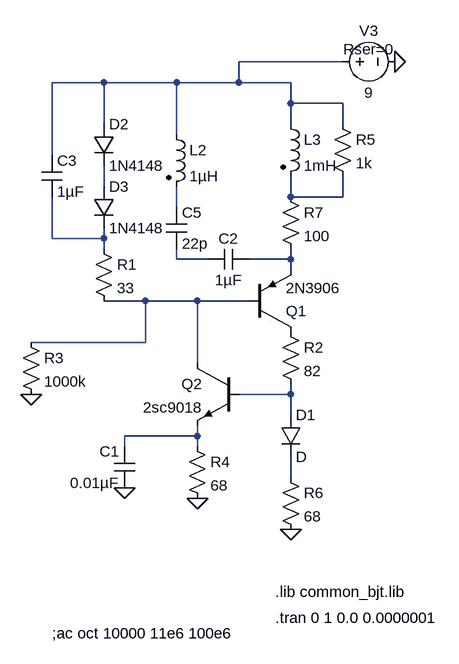
[diagram p0: schematic scr-oscillator.asc]
scr-oscillator.asc, the LTspice schematic file:
Version 4
SHEET 1 880 680
WIRE 112 -400 -48 -400
WIRE -256 -368 -336 -368
WIRE -144 -368 -256 -368
WIRE -48 -368 -48 -400
WIRE -48 -368 -144 -368
WIRE 32 -368 -48 -368
WIRE 32 -336 32 -368
WIRE 112 -336 32 -336
WIRE -256 -304 -256 -368
WIRE 32 -304 32 -336
WIRE 112 -304 112 -336
WIRE -144 -288 -144 -368
WIRE -336 -256 -336 -368
WIRE -256 -208 -256 -240
WIRE 32 -192 32 -224
WIRE 112 -192 112 -224
WIRE 112 -192 32 -192
WIRE -144 -176 -144 -208
WIRE -336 -128 -336 -192
WIRE -256 -128 -256 -144
WIRE -256 -128 -336 -128
WIRE -256 -112 -256 -128
WIRE -144 -96 -144 -112
WIRE -96 -96 -144 -96
WIRE 32 -96 32 -112
WIRE 32 -96 -32 -96
WIRE 32 -80 32 -96
WIRE -192 -32 -256 -32
WIRE -112 -32 -192 -32
WIRE -32 -32 -112 -32
WIRE -192 32 -192 -32
WIRE -192 32 -368 32
WIRE -112 64 -112 -32
WIRE 32 112 32 96
WIRE 32 112 -48 112
WIRE 32 144 32 112
WIRE -112 176 -112 160
WIRE -112 176 -224 176
WIRE -224 192 -224 176
WIRE -112 192 -112 176
WIRE 32 240 32 208
WIRE 0 0 0 0
FLAG 192 -400 0
FLAG -112 272 0
FLAG 32 320 0
FLAG -224 256 0
FLAG -368 112 0
SYMBOL res 16 0 R0
SYMATTR InstName R2
SYMATTR Value 82
SYMBOL cap -32 -112 R90
WINDOW 0 0 32 VBottom 2
WINDOW 3 32 32 VTop 2
SYMATTR InstName C2
SYMATTR Value 1µF
SYMBOL cap -208 256 R180
WINDOW 0 24 56 Left 2
WINDOW 3 24 8 Left 2
SYMATTR InstName C1
SYMATTR Value 0.01µF
SYMBOL npn -48 64 M0
SYMATTR InstName Q2
SYMATTR Value 2sc9018
SYMBOL res -128 176 R0
SYMATTR InstName R4
SYMATTR Value 68
SYMBOL ind2 -160 -304 R0
SYMATTR InstName L2
SYMATTR Value 1µH
SYMATTR SpiceLine Ipk=3 Rser=0.0 Rpar=1e22 Cpar=0
SYMATTR Type ind
SYMBOL ind2 16 -320 R0
SYMATTR InstName L3
SYMATTR Value 1mH
SYMATTR SpiceLine Ipk=3 Rser=0.0478 Rpar=1e22 Cpar=0
SYMATTR Type ind
SYMBOL voltage 96 -400 R270
WINDOW 0 32 56 VTop 2
WINDOW 3 -32 56 VBottom 2
WINDOW 123 0 0 Left 2
WINDOW 39 4 56 VTop 2
SYMATTR InstName V3
SYMATTR Value 9
SYMATTR SpiceLine Rser=0
SYMBOL res 16 224 R0
SYMATTR InstName R6
SYMATTR Value 68
SYMBOL res 16 -208 R0
SYMATTR InstName R7
SYMATTR Value 100
SYMBOL pnp -32 16 M180
SYMATTR InstName Q1
SYMATTR Value 2N3906
SYMBOL diode 16 144 R0
SYMATTR InstName D1
SYMBOL diode -272 -304 R0
SYMATTR InstName D2
SYMATTR Value 1N4148
SYMBOL diode -272 -208 R0
SYMATTR InstName D3
SYMATTR Value 1N4148
SYMBOL cap -160 -176 R0
SYMATTR InstName C5
SYMATTR Value 22p
SYMBOL res -272 -128 R0
SYMATTR InstName R1
SYMATTR Value 33
SYMBOL res -384 16 R0
SYMATTR InstName R3
SYMATTR Value 1000k
SYMBOL res 96 -320 R0
SYMATTR InstName R5
SYMATTR Value 1k
SYMBOL cap -352 -256 R0
SYMATTR InstName C3
SYMATTR Value 1µF
TEXT 8 416 Left 2 !.lib common_bjt.lib
TEXT 8 456 Left 2 !.tran 0 1 0.0 0.0000001
TEXT -336 480 Left 2 !;ac oct 10000 11e6 100e6

The netlist it stands for:
* scr-oscillator.asc
R2 P001 N009 82
C2 N007 N006 1µF
C1 0 N010 0.01µF
Q2 N008 N009 N010 0 2sc9018
R4 N010 0 68
L2 N001 N004 1µH Ipk=3 Rser=0.0 Rpar=1e22 Cpar=0
L3 N001 N003 1mH Ipk=3 Rser=0.0478 Rpar=1e22 Cpar=0
V3 N001 0 9 Rser=0
R6 N011 0 68
R7 N003 N007 100
Q1 P001 N008 N007 0 2N3906
D1 N009 N011 D
D2 N001 N002 1N4148
D3 N002 N005 1N4148
C5 N004 N006 22p
R1 N005 N008 33
R3 N008 0 1000k
R5 N001 N003 1k
C3 N001 N005 1µF
.model D D
.lib standard.dio
.model NPN NPN
.model PNP PNP
.lib standard.bjt
.lib common_bjt.lib
.tran 0 1 0.0 0.0000001
;ac oct 10000 11e6 100e6
.backanno
.end